# Altium schematic sheet RFOUT DaughterBoard.SchDoc
size A; SheetNumber: 1; SheetTotal: 3
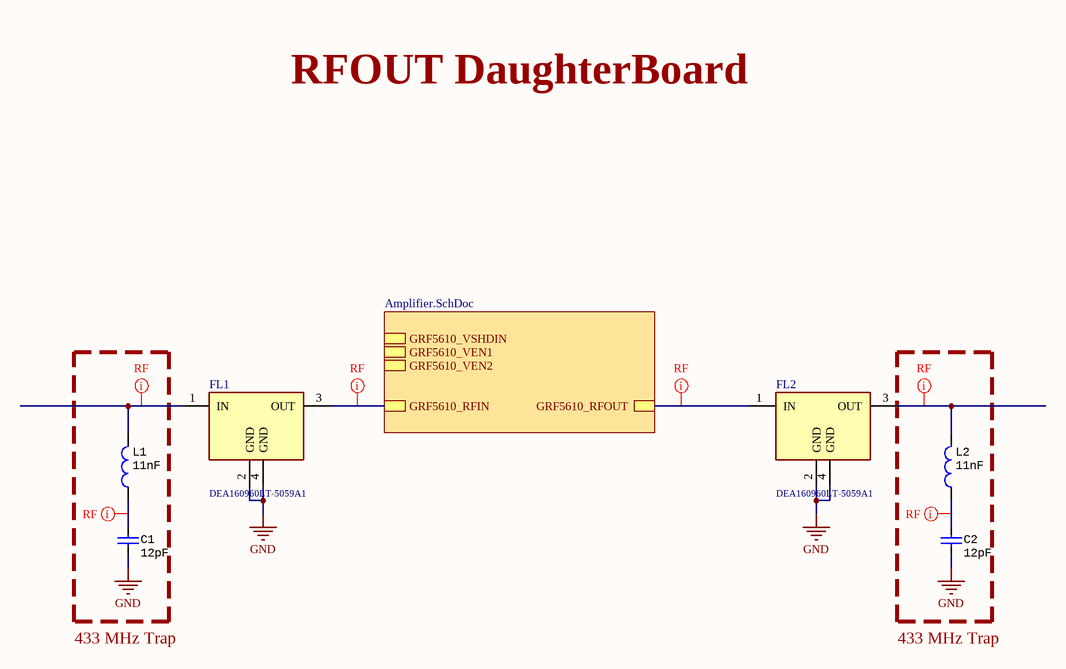
[diagram p0: RFOUT DaughterBoard.SchDoc]

## Parts
C1  12pF  [CAP Ceramic SMD 0402]
C2  12pF  [CAP Ceramic SMD 0402]
FL1  DEA160960LT-5059A1  [DEA160960LT-5059A1]
FL2  DEA160960LT-5059A1  [DEA160960LT-5059A1]
L1  11nF  [IND SMD 0402]
L2  11nF  [IND SMD 0402]

## Sub-sheets
U_Amplifier = Amplifier.SchDoc: GRF5610_VEN1, GRF5610_VEN2, GRF5610_VSHDIN, GRF5610_RFIN, GRF5610_RFOUT

## Nets
GND: C1.2 C2.2 FL1.2(GND) FL1.4(GND) FL2.2(GND) FL2.4(GND)
NetC1_1: C1.1 L1.2
NetC2_1: C2.1 L2.2
NetFL1_1: FL1.1(IN) L1.1
NetFL1_3: FL1.3(OUT) ; sheet U_Amplifier/GRF5610_RFIN
NetFL2_1: FL2.1(IN) ; sheet U_Amplifier/GRF5610_RFOUT
NetFL2_3: FL2.3(OUT) L2.1

## Layout directives
net class RF: NetC1_1, NetC2_1, NetFL1_1, NetFL1_3, NetFL2_1, NetFL2_3

## Notes on the sheet
- RFOUT DaughterBoard
- 433 MHz Trap

## Library data of the parts
C1 C2 = CAP 0402 12pF 50V: CAP CER 12pF 50V C0G 0402; Manufacturer: muRata; Manufacturer Part Number: GJM1555C1H120FB01D; Tolerance: 2%; Voltage Rating: 50V; Supplier: LCSC; Supplier Part Number: C161304; Capacitance: 12pF
FL1 FL2 = DEA160960LT-5059A1: Multilayer Low Pass Filter For 698 - 960 MHz; Manufacturer: TDK; Manufacturer Part Number: DEA160960LT-5059A1; Supplier: LCSC; Supplier Part Number: C695578
L1 L2 = IND 0402 11nH: FIXED IND 11nH 1.4A 83mΩ 0402; Manufacturer: muRata; Manufacturer Part Number: LQW15AN11NG8ZD; Supplier: LCSC; Supplier Part Number: C2044108